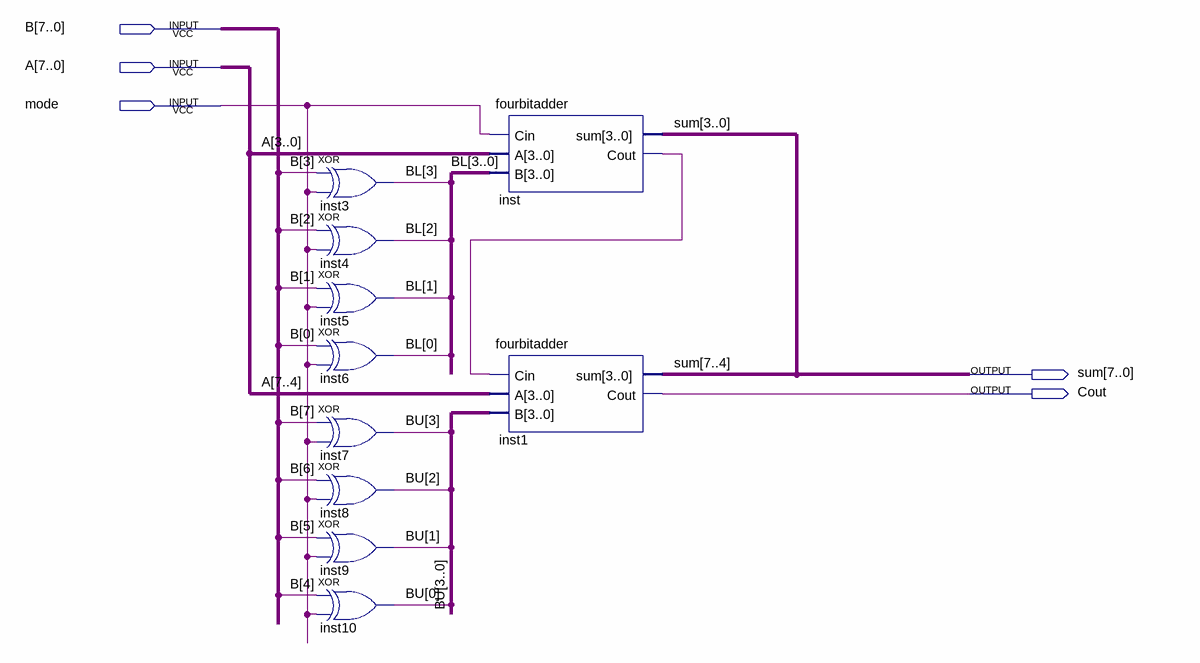
[diagram p0: schematic sheet]
// Quartus schematic eightbitadder.bdf as structural Verilog: 10 symbols, 5 pins
module eightbitadder (
  input  [7:0] B,
  input  [7:0] A,
  input  mode,
  output [7:0] sum,
  output Cout
);

  wire inst_cout;
  wire [3:0] BL, BU;

  xor inst3 (BL[3], B[3], mode);
  xor inst4 (BL[2], B[2], mode);
  xor inst5 (BL[1], B[1], mode);
  xor inst6 (BL[0], B[0], mode);
  xor inst7 (BU[3], B[7], mode);
  xor inst8 (BU[2], B[6], mode);
  xor inst9 (BU[1], B[5], mode);
  xor inst10 (BU[0], B[4], mode);
  fourbitadder inst (.Cin(mode), .A(A[3:0]), .B(BL), .sum(sum[3:0]), .Cout(inst_cout));
  fourbitadder inst1 (.Cin(inst_cout), .A(A[7:4]), .B(BU), .sum(sum[7:4]), .Cout(Cout));
endmodule
